# EAGLE design G1-4 (EAGLE 7.6.0)
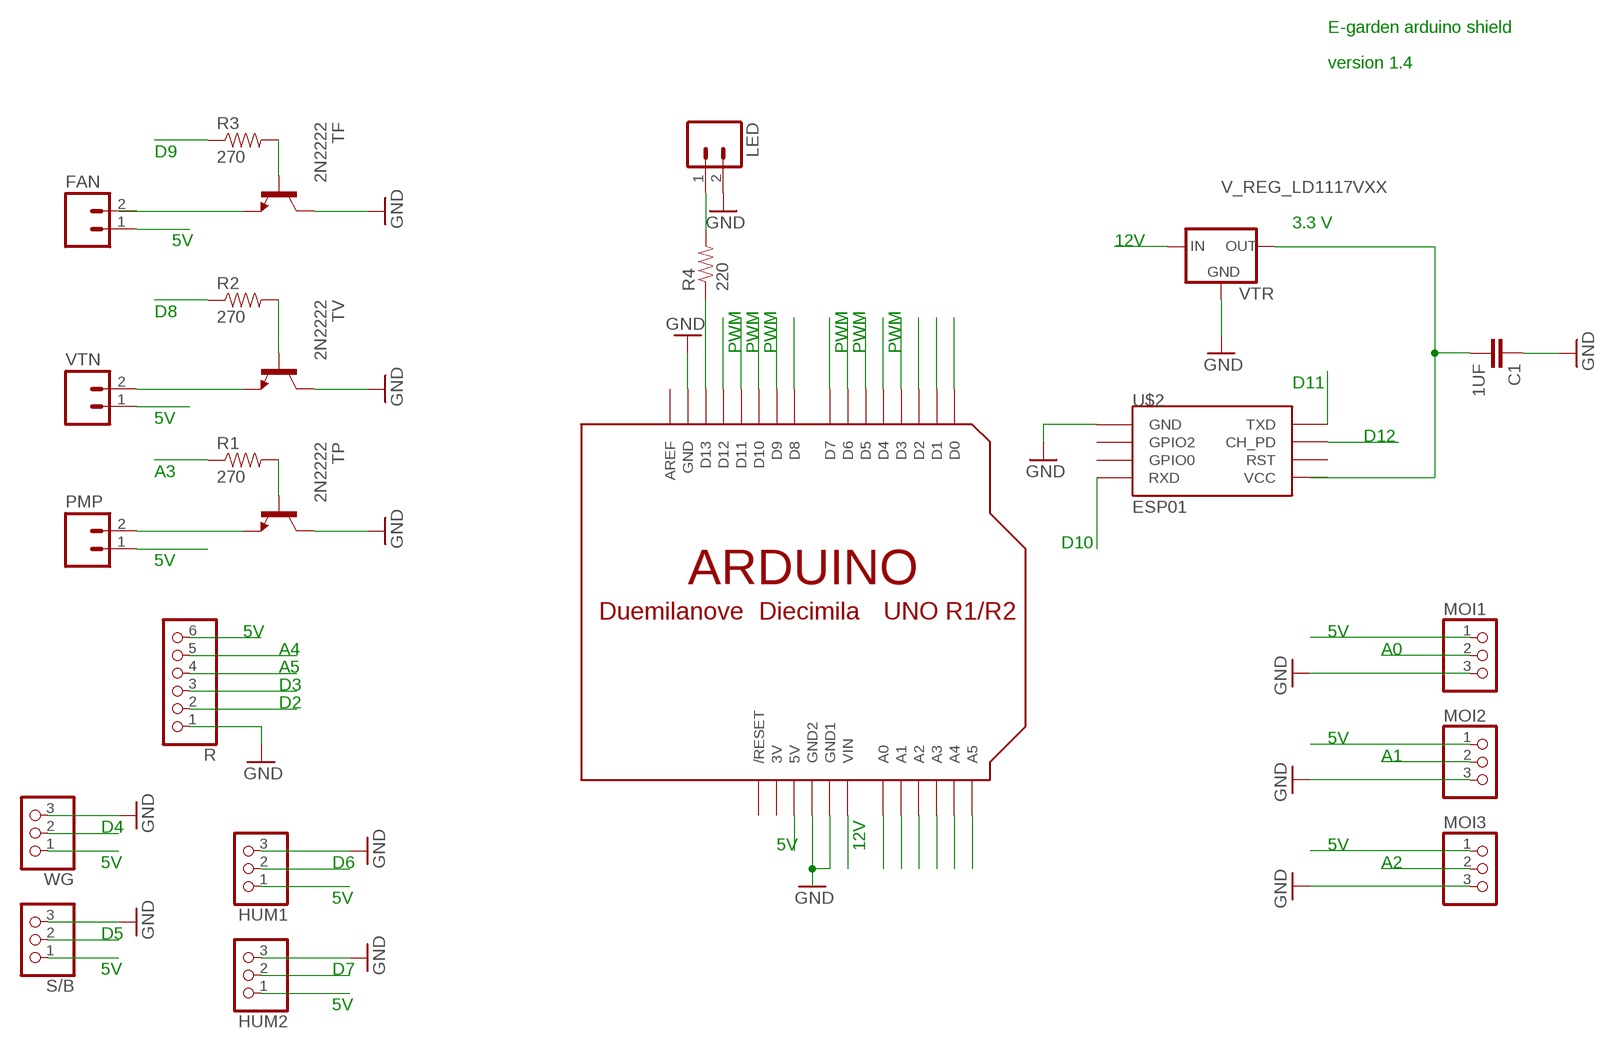
[diagram p0: schematic, sheet 1]

## Parts
C1  1UF  CAPKIT  [CAP-PTH-SMALL-KIT]
FAN  M02PTH  [1X02]
HUM1  PINHD-1X3CB  [1X03-CLEANBIG]
HUM2  PINHD-1X3CB  [1X03-CLEANBIG]
LED  M02PTH  [1X02]
MOI1  PINHD-1X3CB  [1X03-CLEANBIG]
MOI2  PINHD-1X3CB  [1X03-CLEANBIG]
MOI3  PINHD-1X3CB  [1X03-CLEANBIG]
PMP  M02PTH  [1X02]
R  PINHD-1X6CB  [1X06-CLEANBIG]
R1  270  RESISTORPTH-1/4W  [AXIAL-0.4]
R2  270  RESISTORPTH-1/4W  [AXIAL-0.4]
R3  270  RESISTORPTH-1/4W  [AXIAL-0.4]
R4  220  RESISTORPTH-1/4W  [AXIAL-0.4]
S/B  PINHD-1X3CB  [1X03-CLEANBIG]
TF  2N2222  [TO92-EBC-OVAL]
TP  2N2222  [TO92-EBC-OVAL]
TV  2N2222  [TO92-EBC-OVAL]
U$1  ARDUINO-BPLACE  [ARDUINO-BPLACE]
U$2  ESP01  [ESP01]
VTN  M02PTH  [1X02]
VTR  V_REG_LD1117VXX  [78XXL]
WG  PINHD-1X3CB  [1X03-CLEANBIG]

## Nets
A0: MOI1.2 U$1.A0
A1: MOI2.2 U$1.A1
A2: MOI3.2 U$1.A2
A3: R1.P$1 U$1.A3
A4: R.5 U$1.A4
A5: R.4 U$1.A5
D0: U$1.D0
D1: U$1.D1
D2: R.2 U$1.D2
D3: R.3 U$1.D3
D4: U$1.D4 WG.2
D5: S/B.2 U$1.D5
D6: HUM1.2 U$1.D6
D7: HUM2.2 U$1.D7
D8: R2.P$1 U$1.D8
D9: R3.P$1 U$1.D9
D10: U$1.D10 U$2.RX(RXD)
D11: U$1.D11 U$2.TX(TXD)
D12: U$1.D12 U$2.CH_PD
D13: R4.P$1 U$1.D13
GND: C1.1 HUM1.3 HUM2.3 LED.2 MOI1.3 MOI2.3 MOI3.3 R.1 S/B.3 TF.C TP.C TV.C U$1.GND U$1.GND1 U$1.GND2 U$2.GND VTR.IN(GND) WG.3
N$1: FAN.2 TF.E
N$2: LED.1 R4.P$2
N$4: PMP.2 TP.E
N$5: R3.P$2 TF.B
N$7: R1.P$2 TP.B
N$8: C1.2 U$2.VCC VTR.GND(OUT)
TV: R2.P$2 TV.B
V5: FAN.1 HUM1.1 HUM2.1 MOI1.1 MOI2.1 MOI3.1 PMP.1 R.6 S/B.1 U$1.5V VTN.1 WG.1
V12: U$1.VIN VTR.OUT(IN)
VTR: TV.E VTN.2
Unconnected: U$1.AREF U$1.RESET(/RESET) U$2.GPIO0 U$2.GPIO2 U$2.RST

## Notes on the sheet
- E-garden arduino shield
- version 1.4
- D9
- 3.3 V
- 5V | 12V
- D8
- PWM | PWM | PWM | PWM | PWM | PWM
- D11
- 5V
- D12
- A3
- D10
- 5V
- 5V | 5V
- A4 | A0
- A5
- D3
- D2
- 5V
- A1
- D4
- 5V | 12V | 5V
- 5V | D6 | A2
- 5V
- D5
- 5V | D7
- 5V

## Power pins joined to a net without a drawn wire
3V: U$1.3V

## Library data of the parts
C1 = SparkFun-Capacitors:CAP: Capacitor Standard 0603 ceramic capacitor, and 0.1" leaded capacitor.
FAN LED PMP VTN = SparkFun-Connectors:M02: Standard 2-pin 0.1" header. Use with - straight break away headers ( PRT-00116) - right angle break away headers (PRT-00553) - swiss pins (PRT-00743) - machine pins (PRT-00117) - female headers (PRT-00115) Molex polarized connector foot print use with: PRT-08233 with associated crimp pins and housings. 2.54_SCREWTERM for use with PRT-10571. 3.5mm Screw Terminal footprints for PRT-08084 5mm Screw Terminal footprints for use with PRT-08432
HUM1 HUM2 MOI1-MOI3 S/B WG = adafruit:PINHD-1X3: PIN HEADER
R = adafruit:PINHD-1X6: PIN HEADER
R1-R4 = SparkFun-Passives:RESISTOR: Resistor Basic schematic elements and footprints for 0603, 1206, and PTH resistors.
TF TP TV = adafruit:2N2222: NPN TRANSISTOR Big oval pads
U$1 = adafruit:ARDUINO: Arduino Diecimila/Duemilanove Make a shield with ease, this package has all the named pins as well as the two mounting drill holes and an outline of the USB and DC power connector. The outline is on the DIMENSION layer, so if your board house uses it they will cut the outline to match. http://www.ladyada.net/library/pcb/eaglelibrary.html
U$2 = esp8266modules:ESP01: ESP8266 Wifi module 01
VTR = SparkFun-PowerIC:V_REG_LD1117VXX: LD1117VXX voltage regulator. We carry the 3.3V version (COM-00526) in TO-220 package.

## Board
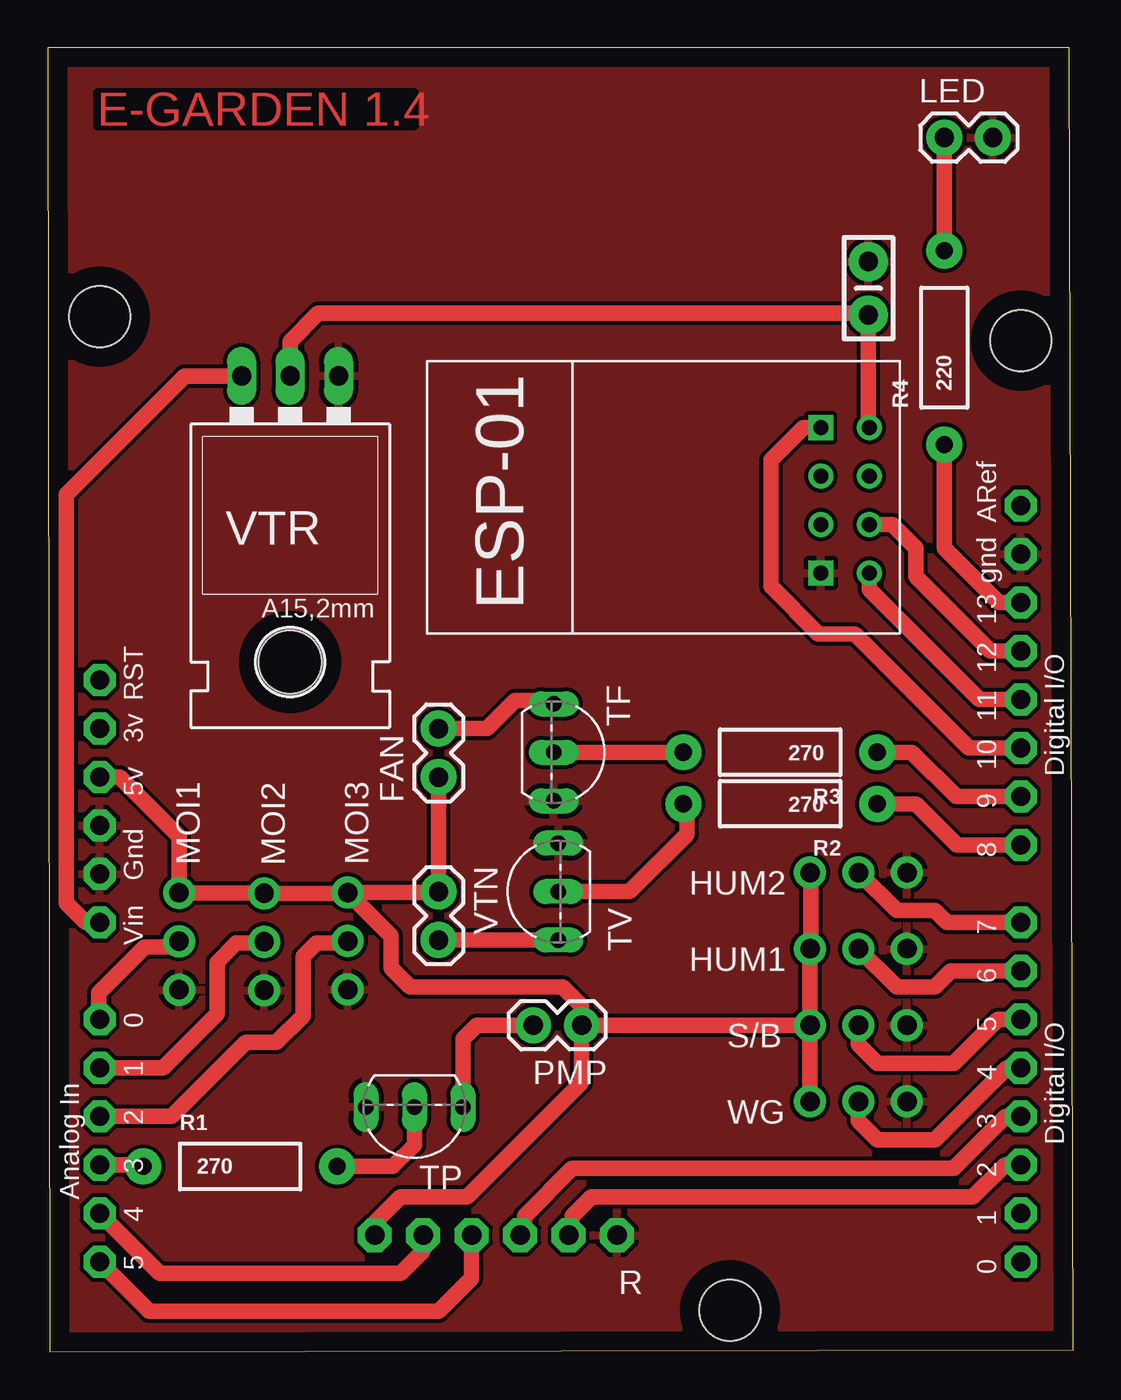
[diagram p1: board, top side]
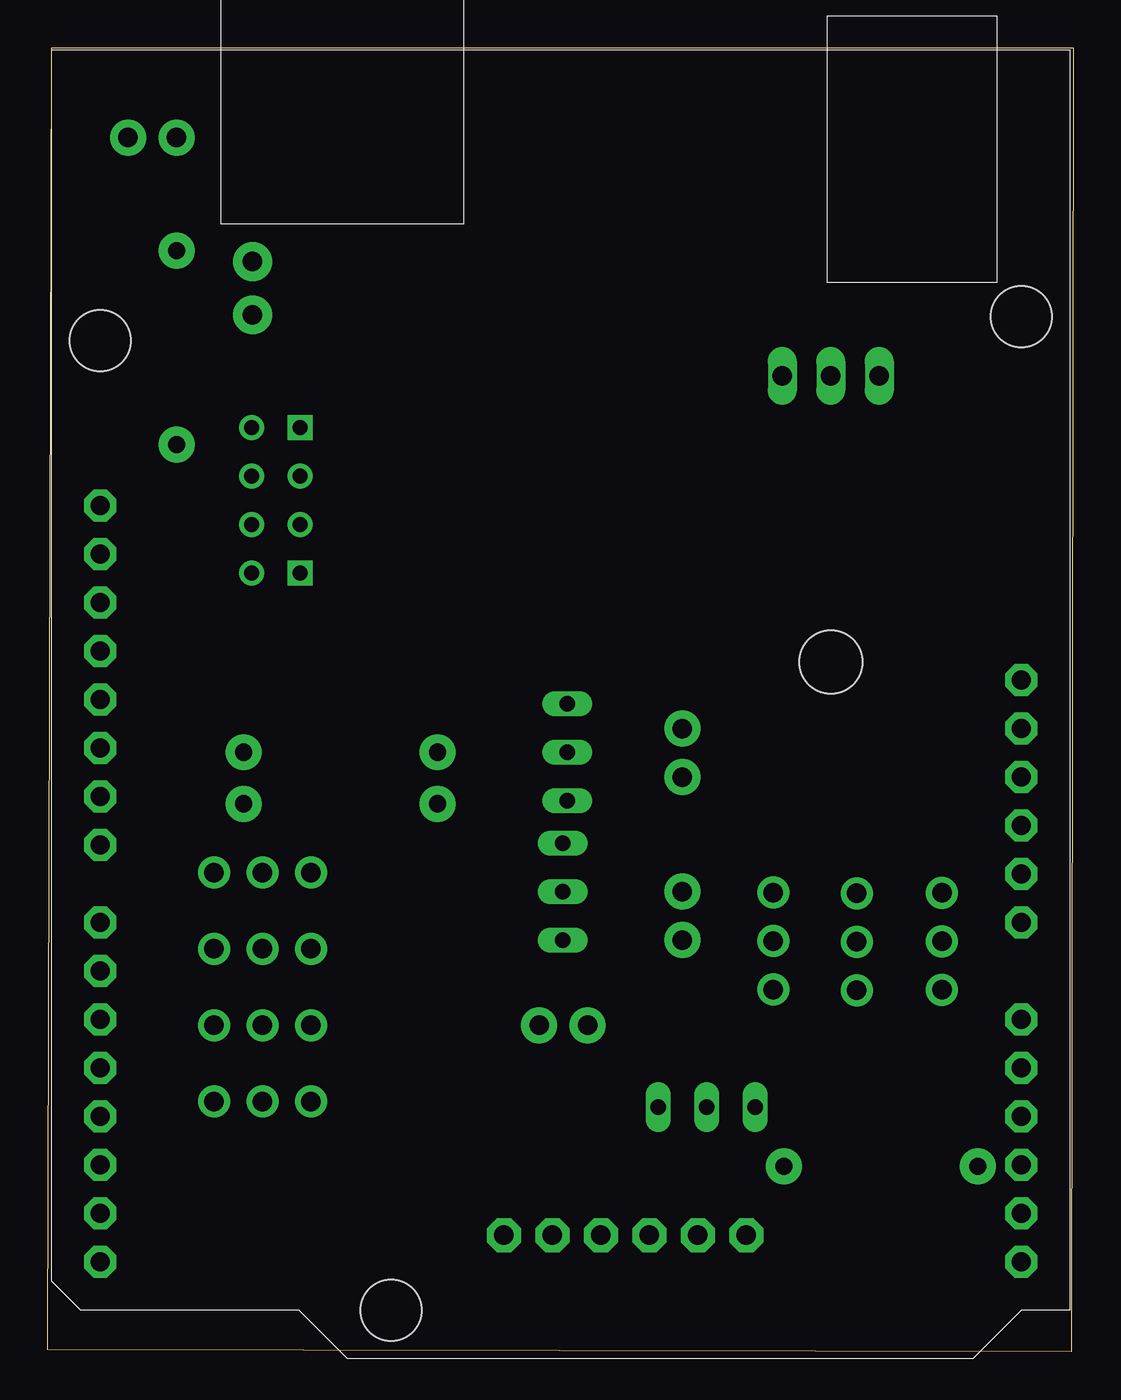
[diagram p2: board, bottom side, seen from below]

Size 53.73 x 68.32 mm. Coordinates in mm from the lower left corner, seen from the top.
Outline: 0.1,0 53.73,0.1 53.53,68.32 0,68.32 0.1,0
Copper layers (1*16): Top 0.035mm / dielectric 1.5mm / Bottom 0.035mm
Design rules "default": minimum track width 10mil, minimum drill 24mil, track to track 8mil, track to pad 8mil, pad to pad 8mil, via to via 8mil, smd to smd 8mil, copper to edge 40mil, drill to drill 8mil, minimum pad ring 10mil, minimum via ring 8mil, stop-mask expansion 4mil, vias tented up to drill 0mil, thermal gap 10mil

### Footprints (pad centres in the part's own frame; a part is rotated, then mirrored left to right if it is on the bottom)
CAP-PTH-SMALL-KIT = drill 1.016 pad 2.032: 1 -1.397,0; 2 1.397,0
1X02 = drill 1.016 pad 1.88: 1 0,0; 2 2.54,0
1X03-CLEANBIG = drill 1.016 pad 1.676: 1 -2.54,0; 2 0,0; 3 2.54,0
1X06-CLEANBIG = drill 1.016 pad 1.778 octagon: 1 -6.35,0; 2 -3.81,0; 3 -1.27,0; 4 1.27,0; 5 3.81,0; 6 6.35,0
AXIAL-0.4 = drill 0.9 pad 1.88: P$1 -5.08,0; P$2 5.08,0
TO92-EBC-OVAL = drill 0.813 long: B 0,-1.27; C 2.54,-1.27; E -2.54,-1.27
ARDUINO-BPLACE = drill 1 pad 1.676 octagon: 3V 35.56,2.54; 5V 38.1,2.54; A0 50.8,2.54; A1 53.34,2.54; A2 55.88,2.54; A3 58.42,2.54; A4 60.96,2.54; A5 63.5,2.54; AREF 23.876,50.8; D0 63.5,50.8; D1 60.96,50.8; D2 58.42,50.8; D3 55.88,50.8; D4 53.34,50.8; D5 50.8,50.8; D6 48.26,50.8; D7 45.72,50.8; D8 41.656,50.8; D9 39.116,50.8; D10 36.576,50.8; D11 34.036,50.8; D12 31.496,50.8; D13 28.956,50.8; GND 26.416,50.8; GND1 43.18,2.54; GND2 40.64,2.54; RESET 33.02,2.54; VIN 45.72,2.54 | hole 3.2: 15.24,50.8; 66.04,35.56; 13.97,2.54
ESP01 = drill 0.8: CH_PD -1.285,-8.178; GPIO0 1.255,-5.638; GPIO2 -1.285,-5.638; RST 1.255,-8.178; TX -3.825,-8.178; VCC 3.795,-8.178 | drill 0.8 square: GND -3.825,-5.638; RX 3.795,-5.638
78XXL = drill 1.016 long: GND 0,-3.81; IN -2.54,-3.81; OUT 2.54,-3.81 | hole 3.302: 0,11.176

### Placement (x,y rotation side)
C1  43,55.72 270 top
FAN  20.48,30.11 90 top
HUM1  42.48,21.11 0 top
HUM2  42.48,25.11 0 top
LED  46.98,63.61 0 top
MOI1  6.88,21.51 270 top
MOI2  11.34,21.48 270 top
MOI3  15.72,21.52 270 top
PMP  27.98,17.11 180 top
R  23.48,6.11 180 top
R1  10.08,9.71 0 top
R2  38.38,28.71 180 top
R3  38.38,31.41 180 top
R4  46.98,52.61 90 top
S/B  42.48,17.11 0 top
TF  27.78,31.41 270 top
TP  19.21,11.55 180 top
TV  25.48,24.11 90 top
U$1  0.18,68.21 270 top
U$2  34.87,44.62 90 top
VTN  20.48,24.11 270 top
VTR  12.7,47.32 180 top
WG  42.48,13.11 0 top

### Tracks (layer width: path | path; a pad name or v marks a point on that pad's centre or on a via)
A0
  Top 0.813: U$1.A0 2.68,17.41 2.68,18.81 5.08,21.21 6.58,21.21 MOI1.2
A1
  Top 0.813: U$1.A1 6.04,14.87 8.88,17.71 8.88,20.41 9.88,21.41 11.27,21.41 MOI2.2
A2
  Top 0.813: U$1.A2 6.5,12.33 10.38,16.21 11.98,16.21 13.38,17.61 13.38,20.71 14.08,21.41 15.61,21.41 MOI3.2
A3
  Top 0.813: U$1.A3 4.92,9.79 R1.P$1
A4
  Top 0.813: U$1.A4 5.86,4.11 18.48,4.11 19.67,5.3 R.5
A5
  Top 0.813: U$1.A5 5.32,2.11 20.48,2.11 22.21,3.84 R.4
D2
  Top 0.813: U$1.D2 50.16,9.79 48.48,8.11 28.48,8.11 27.48,7.11 27.48,6.3 R.2
D3
  Top 0.813: U$1.D3 50.2,12.33 47.48,9.61 27.48,9.61 24.98,7.11 24.98,6.34 R.3
D4
  Top 0.813: U$1.D4 50.24,14.87 46.48,11.11 43.48,11.11 42.48,12.11 WG.2
D5
  Top 0.813: U$1.D5 49.78,17.41 47.48,15.11 43.48,15.11 42.48,16.11 S/B.2
D6
  Top 0.813: U$1.D6 47.32,19.95 46.48,19.11 44.48,19.11 HUM1.2
D7
  Top 0.813: U$1.D7 47.1,22.49 46.48,23.11 44.48,23.11 HUM2.2
D8
  Top 0.813: U$1.D8 47.64,26.55 45.48,28.71 R2.P$1
D9
  Top 0.813: U$1.D9 47.6,29.09 45.28,31.41 R3.P$1
D10
  Top 0.813: U$1.D10 48.26,31.63 42.28,37.61 40.38,37.61 37.88,40.11 37.88,46.71 39.58,48.41 U$2.RX
D11
  Top 0.813: U$1.D11 48.82,34.17 43.05,39.94 U$2.TX
D12
  Top 0.813: U$1.D12 49.38,36.71 45.48,40.61 45.48,42.11 44.25,43.34 U$2.CH_PD
D13
  Top 0.813: U$1.D13 49.84,39.25 46.98,42.11 R4.P$1
GND
  pour Top: 0.18,68.11 53.68,68.21 53.68,0.11 0.08,0.11
N$1
  Top 0.813: FAN.2 23.02,32.65 24.48,34.11 26.85,34.11 TF.E
N$2
  Top 0.813: R4.P$2 LED.1
N$4
  Top 0.813: TP.E 21.75,16.38 22.48,17.11 PMP.2
N$5
  Top 0.813: TF.B R3.P$2
N$7
  Top 0.813: R1.P$2 18.08,9.71 19.21,10.84 TP.B
N$8
  Top 0.813: VTR.GND 12.7,52.93 14.18,54.41 42.91,54.41 C1.2 43,48.46 U$2.VCC
TV
  Top 0.813: TV.B 30.48,24.11 33.48,27.11 33.48,28.53 R2.P$2
V5
  Top 0.813: U$1.5V 3.78,30.11 6.88,27.01 MOI1.1 11.31,24.05 MOI2.1 15.68,24.02 MOI3.1 | MOI3.1 20.43,24.06 VTN.1 FAN.1 | WG.1 S/B.1 | S/B.1 HUM1.1 39.98,21.11 39.98,25.07 HUM2.1 | PMP.1 S/B.1 | PMP.1 27.98,14.11 21.98,8.11 18.48,8.11 17.13,6.76 R.6 | PMP.1 27.98,18.11 26.98,19.11 18.98,19.11 17.98,20.11 17.98,21.8 MOI3.1
V12
  Top 0.813: U$1.VIN 2,22.49 0.98,23.51 0.98,44.91 7.18,51.11 10.14,51.11 VTR.OUT
VTR
  Top 0.813: VTN.2 TV.E

### Text on the board
Top: E-GARDEN 1.4